# Altium project Steering_Unit_ECU.PrjPcb (part 2 of 2)

## Sheet Analog_Signal_Cond.SchDoc
size A; SheetNumber: 4; SheetTotal: 5
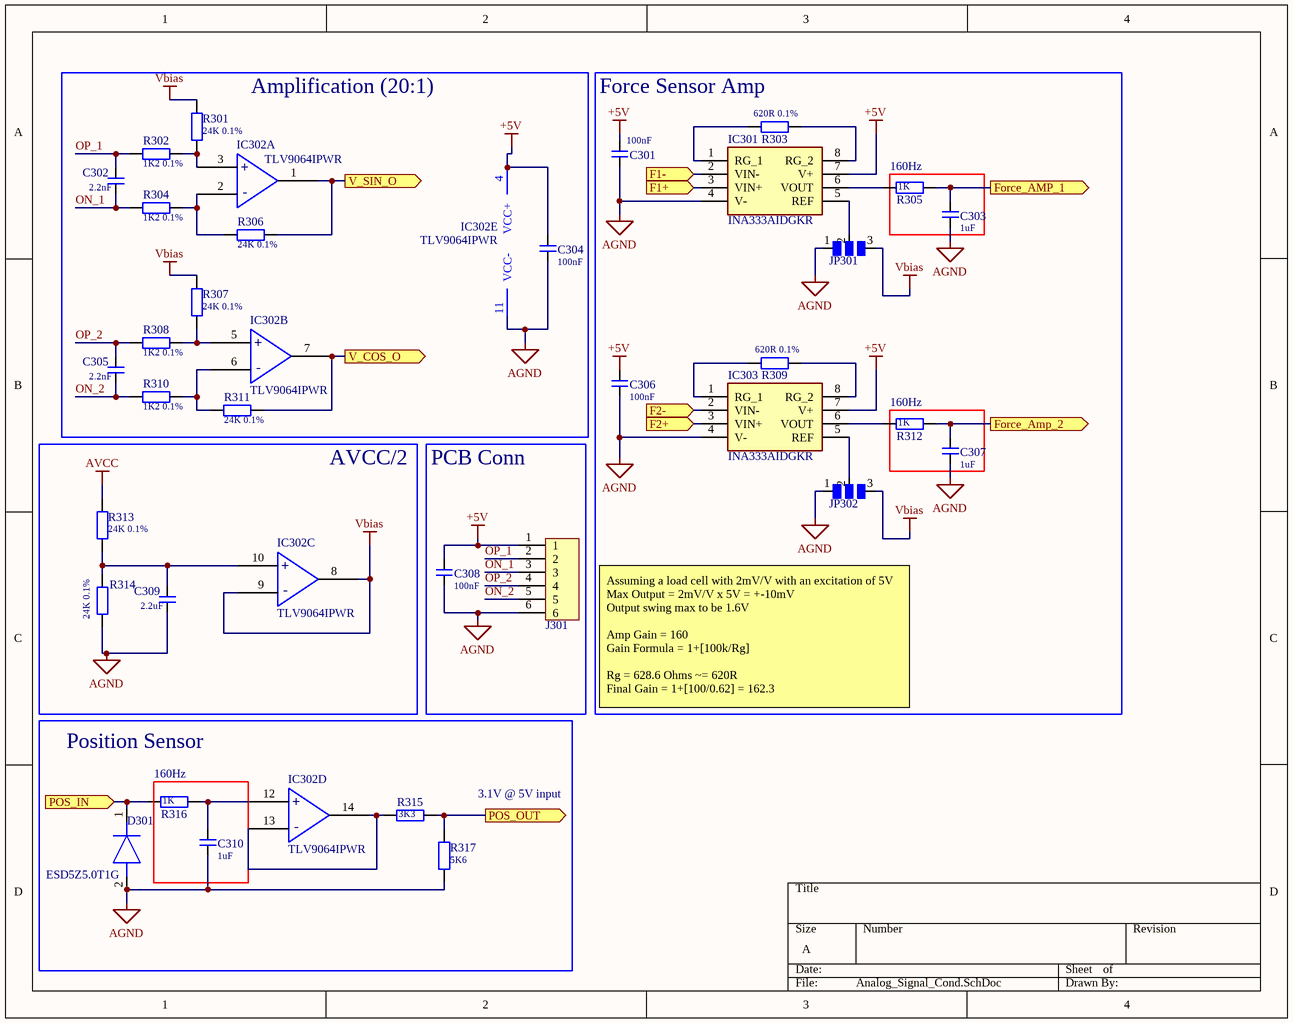
[diagram p4: Analog_Signal_Cond.SchDoc]

### Parts
C301  value 100nF  [CAPC1005X06N]  (hidden comment: Cap)
C302  value 2.2nF  [CAPC1608X09N]  (hidden comment: Cap)
C303  value 1uF  [CAPC1005X06N]  (hidden comment: Cap)
C304  value 100nF  [CAPC1005X06N]  (hidden comment: Cap)
C305  value 2.2nF  [CAPC1608X09N]  (hidden comment: Cap)
C306  value 100nF  [CAPC1005X06N]  (hidden comment: Cap)
C307  value 1uF  [CAPC1005X06N]  (hidden comment: Cap)
C308  value 100nF  [CAPC1005X06N]  (hidden comment: Cap)
C309  value 2.2uF  [CAPC1005X06N]  (hidden comment: Cap)
C310  value 1uF  [CAPC1005X06N]  (hidden comment: Cap)
D301  ESD5Z5.0T1G  [SODFL1608X70N]
IC301  INA333AIDGKR  [SOP65P490X110-8N]
IC302  TLV9064IPWR  [SOP65P640X120-14N]  (parts A,B,C,D,E of 5)
IC303  INA333AIDGKR  [SOP65P490X110-8N]
J301  PCB_Conn_6P  [PCB_CONN_6]  (value not drawn)  (no BOM)
JP301  Jumper_3  [Jumper_3]  (value not drawn)  (no BOM)
JP302  Jumper_3  [Jumper_3]  (value not drawn)  (no BOM)
R301  value 24K 0.1%  [RESC1005X04N]  (hidden comment: R)
R302  value 1K2 0.1%  [RESC1005X04N]  (hidden comment: R)
R303  value 620R 0.1%  [RESC1005X04N]  (hidden comment: R)
R304  value 1K2 0.1%  [RESC1005X04N]  (hidden comment: R)
R305  value 1K  [RESC1005X04N]  (hidden comment: R)
R306  value 24K 0.1%  [RESC1005X04N]  (hidden comment: R)
R307  value 24K 0.1%  [RESC1005X04N]  (hidden comment: R)
R308  value 1K2 0.1%  [RESC1005X04N]  (hidden comment: R)
R309  value 620R 0.1%  [RESC1005X04N]  (hidden comment: R)
R310  value 1K2 0.1%  [RESC1005X04N]  (hidden comment: R)
R311  value 24K 0.1%  [RESC1005X04N]  (hidden comment: R)
R312  value 1K  [RESC1005X04N]  (hidden comment: R)
R313  value 24K 0.1%  [RESC1005X04N]  (hidden comment: R)
R314  value 24K 0.1%  [RESC1005X04N]  (hidden comment: R)
R315  value 3K3  [RESC1005X04N]  (hidden comment: R)
R316  value 1K  [RESC1005X04N]  (hidden comment: R)
R317  value 5K6  [RESC1005X04N]  (hidden comment: R)

### Blocks framed on the sheet
Amplification (20:1): C302 C304 C305 IC302 R301 R302 R304 R306-R308 R310 R311
Force Sensor Amp: C301 C306 IC301 IC303 JP301 JP302 R303 R309
160Hz: C303 R305
AVCC/2: C309 IC302 R313 R314
PCB Conn: C308 J301
160Hz: C307 R312
Position Sensor: D301 IC302 R315 R317
160Hz: C310 R316

### Ports
F1+ (in, see Main_CPU[7A]), F1- (in, see Main_CPU[7A]), F2+ (in, see Main_CPU[7A]), F2- (in, see Main_CPU[7A]), Force_AMP_1 (out, see Main_CPU[8A]), Force_Amp_2 (out, see Main_CPU[8A]), POS_IN (in, see Main_CPU[7A]), POS_OUT (out, see Main_CPU[8A]), V_COS_O (out, see Main_CPU[8A]), V_SIN_O (out, see Main_CPU[8A])

### Nets
+5V: C301.2 C304.2 C306.2 C308.2 IC301.7(V+) IC302.4(VCC+) IC303.7(V+) J301.1
AGND: C301.1 C303.2 C304.1 C306.1 C307.2 C308.1 C309.1 C310.2 D301.2(A) IC301.4(V-) IC302.11(VCC-) IC303.4(V-) J301.6 JP301.1 JP302.1 R314.1 R317.2
AVCC: R313.2
Vbias: IC302.8(OUTC) IC302.9(IN-C) JP301.3 JP302.3 R301.1 R307.2
ADC_COS: IC302.7(OUTB) R311.2 ; port V_COS_O
ADC_FRC_1: C303.1 R305.1 ; port Force_AMP_1
ADC_FRC_2: C307.1 R312.1 ; port Force_Amp_2
ADC_POS: R315.1 R317.1 ; port POS_OUT
ADC_SIN: IC302.1(OUTA) R306.2 ; port V_SIN_O
ON_1: C302.1 J301.3 R304.2
ON_2: C305.1 J301.5 R310.2
OP_1: C302.2 J301.2 R302.2
OP_2: C305.2 J301.4 R308.2
NetC309_2: C309.2 IC302.10(In+C) R313.1 R314.2
NetC310_1: C310.1 IC302.12(In+D) R316.1
NetD301_1: D301.1(K) R316.2 ; port POS_IN
NetIC301_1: IC301.1(RG_1) R303.2
NetIC301_2: IC301.2(VIN-) ; port F1-
NetIC301_3: IC301.3(VIN+) ; port F1+
NetIC301_5: IC301.5(REF) JP301.2
NetIC301_6: IC301.6(VOUT) R305.2
NetIC301_8: IC301.8(RG_2) R303.1
NetIC302_2: IC302.2(IN-A) R304.1 R306.1
NetIC302_3: IC302.3(In+A) R301.2 R302.1
NetIC302_5: IC302.5(In+B) R307.1 R308.1
NetIC302_6: IC302.6(IN-B) R310.1 R311.1
NetIC302_13: IC302.13(IN-D) IC302.14(OUTD) R315.2
NetIC303_1: IC303.1(RG_1) R309.2
NetIC303_2: IC303.2(VIN-) ; port F2-
NetIC303_3: IC303.3(VIN+) ; port F2+
NetIC303_5: IC303.5(REF) JP302.2
NetIC303_6: IC303.6(VOUT) R312.2
NetIC303_8: IC303.8(RG_2) R309.1

### Notes on the sheet
- Assuming a load cell with 2mV/V with an excitation of 5V
  Max Output = 2mV/V x 5V = +-10mV
  Output swing max to be 1.6V
  Amp Gain = 160
  Gain Formula = 1+[100k/Rg]
  Rg = 628.6 Ohms ~= 620R
  Final Gain = 1+[100/0.62] = 162.3
- 3.1V @ 5V input
- (in symbol TLV9064IPWR, part A) +; -
- (in symbol TLV9064IPWR, part B) +; -
- (in symbol TLV9064IPWR, part C) +; -
- (in symbol TLV9064IPWR, part D) +; -

### Library data of the parts
C301 C304 C306 C308 = Cap: Capacitor; MPN: GCM155R71H104KE02D; Link: https://jlcpcb.com/partdetail/MurataElectronics-GCM155R71H104KE02D/C85858; Price: 0.0031
C302 C305 = Cap: Capacitor; MPN: CC0603KRX7R9BB222; Link: https://www.lcsc.com/product-detail/Multilayer-Ceramic-Capacitors-MLCC-SMD-SMT_YAGEO-CC0603KRX7R9BB222_C107082.html; Price: 0.0024
C303 C307 C310 = Cap: Capacitor; MPN: GRM155Z71A105KE01D; Link: https://jlcpcb.com/partdetail/548880-GRM155Z71A105KE01D/C528974; Price: 0.0206
C309 = Cap: Capacitor; MPN: GRM155Z71A225KE44D; Link: https://jlcpcb.com/partdetail/3478404-GRM155Z71A225KE44D/C2999759; Price: 0.0332
D301 = ESD5Z5.0T1G: Diode; Manufacturer_Name: onsemi; Datasheet Link: http://www.onsemi.com/pub/Collateral/ESD5Z2.5T1-D.PDF; Height: 0.7mm; Mouser Part Number: 863-ESD5Z5.0T1G; Mouser Price/Stock: https://www.mouser.co.uk/ProductDetail/onsemi/ESD5Z5.0T1G?qs=OSf9jACorvYw3fDx1S8P6A%3D%3D; Arrow Part Number: ESD5Z5.0T1G; Arrow Price/Stock: https://www.arrow.com/en/products/esd5z5.0t1g/on-semiconductor?utm_currency=USD&region=nac; MPN: ESD5Z5.0T1G; link: https://www.lcsc.com/product-detail/ESD-and-Surge-Protection-TVS-ESD_BORN-ESD5Z5-0T1G_C343989.html?s_z=n_ESD5Z5.0T1G
IC301 IC303 = INA333AIDGKR: Integrated Circuit; Manufacturer_Name: Texas Instruments; Datasheet Link: http://www.ti.com/lit/ds/symlink/ina333.pdf; Height: 1.1mm; MPN: INA333AIDGKR; Mouser Part Number: 595-INA333AIDGKR; Mouser Price/Stock: https://www.mouser.co.uk/ProductDetail/Texas-Instruments/INA333AIDGKR?qs=nJRxFdq%252BlvaKwfZOdHFpKg%3D%3D; Arrow Part Number: INA333AIDGKR; Arrow Price/Stock: https://www.arrow.com/en/products/ina333aidgkr/texas-instruments?utm_currency=USD&region=nac; Link: https://www.lcsc.com/product-detail/Instrumentation-Amplifiers_Texas-Instruments-INA333AIDGKR_C19450.html; Price: 0.873
IC302 = TLV9064IPWR: Integrated Circuit; Manufacturer_Name: Texas Instruments; Datasheet Link: http://www.ti.com/lit/ds/symlink/tlv9064.pdf; Height: 1.2mm; MPN: TLV9064IPWR; Mouser Part Number: 595-TLV9064IPWR; Mouser Price/Stock: https://www.mouser.co.uk/ProductDetail/Texas-Instruments/TLV9064IPWR?qs=W0yvOO0ixfHY9ZUvwjcceA%3D%3D; Arrow Part Number: TLV9064IPWR; Arrow Price/Stock: https://www.arrow.com/en/products/tlv9064ipwr/texas-instruments?utm_currency=USD&region=nac; Link: https://www.lcsc.com/product-detail/Operational-Amplifier_Texas-Instruments-TLV9064IPWR_C779410.html; Price: 0.2524
R301 R306 R307 R311 R313 R314 = R: Resistor; MPN: AR02BTD2402; Link: https://www.lcsc.com/product-detail/Chip-Resistor-Surface-Mount_Viking-Tech-AR02BTD2402_C319712.html; Price: 0.0229
R302 R304 R308 R310 = R: Resistor; MPN: RT0603BRD071K2L; Link: https://www.lcsc.com/product-detail/Chip-Resistor-Surface-Mount_YAGEO-RT0603BRD071K2L_C136970.html; Price: 0.0229
R303 R309 = R: Resistor; MPN: RT0402BRD0710KL; Link: https://jlcpcb.com/partdetail/Yageo-RT0402BRD0710KL/C190095; Price: 0.0156
R305 R312 R316 = R: Resistor; MPN: RC0402FR-071KL; Link: RC0402FR-071KL; Price: 0.0006
R315 = R: Resistor; MPN: RC0402FR-073K3L; Link: https://jlcpcb.com/partdetail/Yageo-RC0402FR073K3L/C137992; Price: 0.0006
R317 = R: Resistor; MPN: RC0402FR-075K6L; Link: https://jlcpcb.com/partdetail/Yageo-RC0402FR075K6L/C163457; Price: 0.0005

## Nets that join several sheets
+5V: Main_CPU (13 pins), Gate_Driver (C220.1 IC203.2 IC203.4), Analog_Signal_Cond (8 pins)
AGND: Main_CPU (18 pins), Analog_Signal_Cond (17 pins)
AVCC: Main_CPU (6 pins), Gate_Driver (IC202.24), Analog_Signal_Cond (R313.2)
DC_BUS: Main_CPU (R126.1), Gate_Driver (10 pins), Inverter (7 pins)
GND: Main_CPU (48 pins), Gate_Driver (26 pins), Inverter (8 pins), Dig_Encoder_Interface (8 pins)
VDD: Main_CPU (35 pins), Gate_Driver (IC202.49), Dig_Encoder_Interface (8 pins)
A_COM: Gate_Driver (C214.1 IC201.14 IC202.46), Inverter (5 pins)
A_HIGH: Gate_Driver (R206.1), Inverter (Jleft_503.1 Q1.1)
A_LOW: Gate_Driver (R207.1), Inverter (Jleft_507.1 Q4.1)
A_S_L: Gate_Driver (IC202.44), Inverter (Jleft_505.1 Q4.2 RS1.2)
ADC_COS: Main_CPU (IC101.22), Analog_Signal_Cond (IC302.7 R311.2)
ADC_FRC_1: Main_CPU (IC101.10), Analog_Signal_Cond (C303.1 R305.1)
ADC_FRC_2: Main_CPU (IC101.11), Analog_Signal_Cond (C307.1 R312.1)
ADC_Ia: Main_CPU (IC101.17), Gate_Driver (C222.2 R212.2)
ADC_Ib: Main_CPU (IC101.20), Gate_Driver (C221.2 R213.2)
ADC_Inv_Temp: Main_CPU (C101.2 IC101.8 R106.2), Inverter (Jbot_503.1 R4.1)
ADC_POS: Main_CPU (IC101.27), Analog_Signal_Cond (R315.1 R317.1)
ADC_SIN: Main_CPU (IC101.21), Analog_Signal_Cond (IC302.1 R306.2)
B_COM: Gate_Driver (C216.1 IC201.12 IC202.41), Inverter (5 pins)
B_HIGH: Gate_Driver (R208.1), Inverter (Jright_503.1 Q2.1)
B_LOW: Gate_Driver (R209.1), Inverter (Jright_507.1 Q6.1)
B_SRC_LOW: Gate_Driver (IC202.39), Inverter (Jright_505.1 Q6.2 RS2.2)
C_COM: Gate_Driver (C218.1 IC201.10 IC202.36), Inverter (5 pins)
C_HIGH: Gate_Driver (R210.1), Inverter (Jbot_505.1 Q3.1)
C_LOW: Gate_Driver (R211.1), Inverter (Jbot_507.1 Q8.1)
C_SRC_LOW: Gate_Driver (IC202.34), Inverter (Jbot_504.1 NT501.1)
DRV_DC_CAL: Main_CPU (IC101.30), Gate_Driver (IC202.12)
DRV_nFLT: Main_CPU (IC101.3), Gate_Driver (IC202.6)
DRV_nOCTW: Main_CPU (IC101.2), Gate_Driver (IC202.5)
DRV_PWRGD: Main_CPU (IC101.4), Gate_Driver (IC202.4)
EN_INV: Main_CPU (IC101.33), Gate_Driver (IC201.6 IC201.7 IC201.8 IC202.16)
ENC_A: Main_CPU (IC101.59), Dig_Encoder_Interface (IC401.2)
ENC_B: Main_CPU (IC101.58), Dig_Encoder_Interface (IC401.4)
HALL_A: Main_CPU (IC101.14), Dig_Encoder_Interface (IC401.8)
HALL_B: Main_CPU (IC101.15), Dig_Encoder_Interface (IC401.10)
HALL_C: Main_CPU (IC101.16), Dig_Encoder_Interface (IC401.12)
NetD301_1: Main_CPU (J103.2), Analog_Signal_Cond (D301.1 R316.2)
NetIC301_2: Main_CPU (J101.2), Analog_Signal_Cond (IC301.2)
NetIC301_3: Main_CPU (J101.3), Analog_Signal_Cond (IC301.3)
NetIC303_2: Main_CPU (J102.2), Analog_Signal_Cond (IC303.2)
NetIC303_3: Main_CPU (J102.3), Analog_Signal_Cond (IC303.3)
NetJ109_2: Main_CPU (J109.2), Dig_Encoder_Interface (R407.2)
NetJ109_3: Main_CPU (J109.3), Dig_Encoder_Interface (R408.2)
NetJ109_4: Main_CPU (J109.4), Dig_Encoder_Interface (R409.2)
NetJ109_5: Main_CPU (J109.5), Dig_Encoder_Interface (R410.2)
NetJ109_6: Main_CPU (J109.6), Dig_Encoder_Interface (R411.2)
NetJ109_7: Main_CPU (J109.7), Dig_Encoder_Interface (R412.2)
P_DISC_A: Gate_Driver (IC201.15), Inverter (Jleft_508.1 Q5.1 R1.2)
P_DISC_C: Gate_Driver (IC201.11), Inverter (Jbot_508.1 Q9.1 R3.2)
PDISC_B: Gate_Driver (IC201.13), Inverter (Jright_508.1 Q7.1 R2.2)
PWM_A_N: Main_CPU (IC101.23), Gate_Driver (IC202.18)
PWM_A_P: Main_CPU (IC101.37), Gate_Driver (IC202.17)
PWM_B_N: Main_CPU (IC101.35), Gate_Driver (IC202.20)
PWM_B_P: Main_CPU (IC101.38), Gate_Driver (IC202.19)
PWM_C_N: Main_CPU (IC101.36), Gate_Driver (IC202.22)
PWM_C_P: Main_CPU (IC101.39), Gate_Driver (IC202.21)
PWM_IN_ENC_Z: Main_CPU (IC101.50 J104.10), Dig_Encoder_Interface (IC401.6)
S1_N: Gate_Driver (C225.2 IC202.33), Inverter (Jleft_504.1)
S1_P: Gate_Driver (C225.1 IC202.32), Inverter (Jleft_502.1)
S2_N: Gate_Driver (C226.1 IC202.30), Inverter (Jright_504.1)
S2_P: Gate_Driver (C226.2 IC202.31), Inverter (Jright_502.1)
SPI_MISO: Main_CPU (IC101.56 J104.7), Gate_Driver (IC202.10)
SPI_MOSI: Main_CPU (IC101.57 J104.9), Gate_Driver (IC202.9)
SPI_SCK: Main_CPU (IC101.55 J104.5), Gate_Driver (IC202.11)
SPI_SS1: Main_CPU (IC101.54), Gate_Driver (IC202.8)
TH1: Main_CPU (NT102.1), Inverter (Jbot_502.1 R4.2)